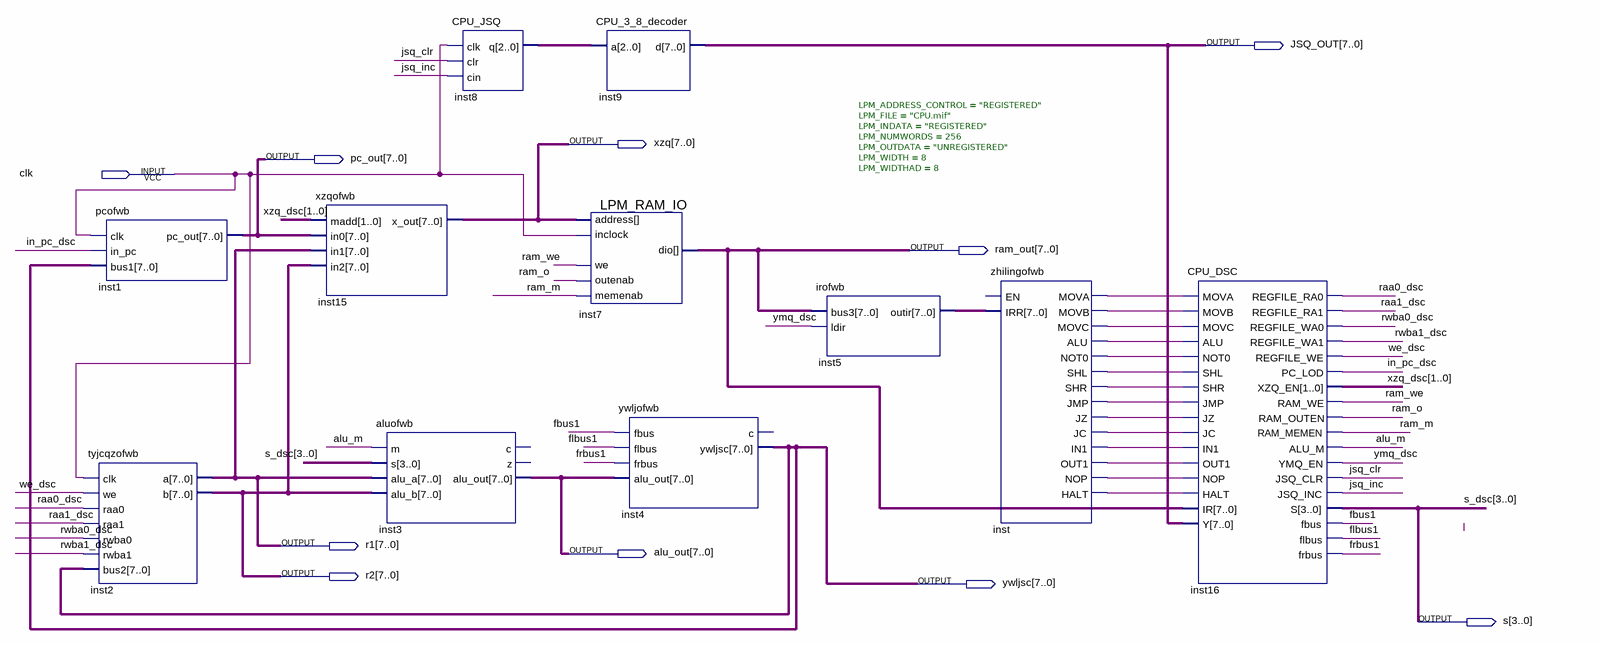
[diagram p0: schematic sheet]
// Quartus schematic cpuofwbzuishuai.bdf as structural Verilog: 11 symbols, 10 pins
module cpuofwbzuishuai (
  input  clk,
  output [7:0] JSQ_OUT,
  output [7:0] xzq,
  output [7:0] pc_out,
  output [7:0] ram_out,
  output [7:0] r1,
  output [7:0] alu_out,
  output [7:0] r2,
  output [7:0] ywljsc,
  output [3:0] s
);

  wire alu_m, fbus1, flbus1, frbus1, in_pc_dsc, inst_alu, inst_halt, inst_in1, inst_jc, inst_jmp, inst_jz,
       inst_mova, inst_movb, inst_movc, inst_nop, inst_not0, inst_out1, inst_shl, inst_shr, jsq_clr, jsq_inc,
       raa0_dsc, raa1_dsc, ram_m, ram_o, ram_we, rwba0_dsc, rwba1_dsc, we_dsc, ymq_dsc;
  wire [1:0] xzq_dsc;
  wire [2:0] inst8_q;
  wire [7:0] inst5_outir;

  pcofwb inst1 (.clk(clk), .in_pc(in_pc_dsc), .bus1(ywljsc), .pc_out(pc_out));
  tyjcqzofwb inst2 (
    .clk(clk), .we(we_dsc), .raa0(raa0_dsc), .raa1(raa1_dsc), .rwba0(rwba0_dsc), .rwba1(rwba1_dsc),
    .bus2(ywljsc), .a(r1), .b(r2));
  xzqofwb inst15 (.madd(xzq_dsc), .in0(pc_out), .in1(r1), .in2(r2), .x_out(xzq));
  aluofwb inst3 (.m(alu_m), .s(s), .alu_a(r1), .alu_b(r2), .alu_out(alu_out));  // open: c, z
  CPU_JSQ inst8 (.clk(clk), .clr(jsq_clr), .cin(jsq_inc), .q(inst8_q));
  CPU_3_8_decoder inst9 (.a(inst8_q), .d(JSQ_OUT));
  LPM_RAM_IO #(.LPM_ADDRESS_CONTROL("REGISTERED"), .LPM_FILE("CPU.mif"), .LPM_INDATA("REGISTERED"), .LPM_NUMWORDS(256), .LPM_OUTDATA("UNREGISTERED"), .LPM_WIDTH(8), .LPM_WIDTHAD(8)) inst7 (
    .address(xzq), .memenab(ram_m), .inclock(clk), .we(ram_we), .outenab(ram_o), .dio(ram_out));
  ywljofwb inst4 (.fbus(fbus1), .flbus(flbus1), .frbus(frbus1), .alu_out(alu_out), .ywljsc(ywljsc));  // open: c
  irofwb inst5 (.bus3(ram_out), .ldir(ymq_dsc), .outir(inst5_outir));
  zhilingofwb inst (
    .IRR(inst5_outir), .MOVA(inst_mova), .MOVB(inst_movb), .MOVC(inst_movc), .ALU(inst_alu),
    .NOT0(inst_not0), .SHL(inst_shl), .SHR(inst_shr), .JMP(inst_jmp), .JZ(inst_jz), .JC(inst_jc),
    .IN1(inst_in1), .OUT1(inst_out1), .NOP(inst_nop), .HALT(inst_halt));  // open: EN
  CPU_DSC inst16 (
    .MOVA(inst_mova), .MOVB(inst_movb), .MOVC(inst_movc), .ALU(inst_alu), .NOT0(inst_not0), .SHL(inst_shl),
    .SHR(inst_shr), .JMP(inst_jmp), .JZ(inst_jz), .JC(inst_jc), .IN1(inst_in1), .OUT1(inst_out1),
    .NOP(inst_nop), .HALT(inst_halt), .IR(ram_out), .Y(JSQ_OUT), .REGFILE_RA0(raa0_dsc),
    .REGFILE_RA1(raa1_dsc), .REGFILE_WA0(rwba0_dsc), .REGFILE_WA1(rwba1_dsc), .REGFILE_WE(we_dsc),
    .PC_LOD(in_pc_dsc), .XZQ_EN(xzq_dsc), .RAM_WE(ram_we), .RAM_OUTEN(ram_o), .RAM_MEMEN(ram_m),
    .ALU_M(alu_m), .YMQ_EN(ymq_dsc), .JSQ_CLR(jsq_clr), .JSQ_INC(jsq_inc), .S(s), .fbus(fbus1),
    .flbus(flbus1), .frbus(frbus1));

  // Other names for the same wires on the sheet: s_dsc[3:0] = s
endmodule
